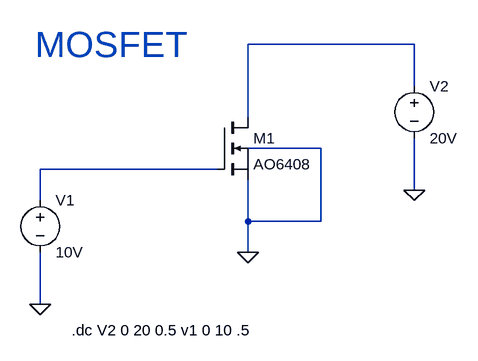
[diagram p0: schematic MOSFET.asc]
MOSFET.asc, the LTspice schematic file:
Version 4
SHEET 1 880 680
WIRE 608 -80 352 -80
WIRE 608 -16 608 -80
WIRE 352 32 352 -80
WIRE 464 80 352 80
WIRE 304 112 32 112
WIRE 608 144 608 64
WIRE 32 160 32 112
WIRE 352 192 352 128
WIRE 464 192 464 80
WIRE 464 192 352 192
WIRE 352 240 352 192
WIRE 32 320 32 240
FLAG 32 320 0
FLAG 352 240 0
FLAG 608 144 0
SYMBOL voltage 32 144 R0
WINDOW 123 0 0 Left 0
WINDOW 39 0 0 Left 0
SYMATTR InstName V1
SYMATTR Value 10V
SYMBOL voltage 608 -32 R0
WINDOW 123 0 0 Left 0
WINDOW 39 0 0 Left 0
SYMATTR InstName V2
SYMATTR Value 20V
SYMBOL nmos 304 32 R0
SYMATTR InstName M1
SYMATTR Value AO6408
TEXT 80 360 Left 2 !.dc V2 0 20 0.5 v1 0 10 .5
TEXT 24 -80 Left 5 ;MOSFET

The netlist it stands for:
* MOSFET.asc
V1 N002 0 10V
V2 N001 0 20V
M1 N001 N002 0 0 AO6408
.model NMOS NMOS
.model PMOS PMOS
.lib standard.mos
.dc V2 0 20 0.5 v1 0 10 .5
* MOSFET
.backanno
.end